# Altium schematic sheet 05_MPU6500.SchDoc
size A4; CheckedBy: <审核日期>; Author: llm; CompanyName: 孔乙己图书店; DocumentNumber: 5; SheetNumber: 5; SheetTotal: 6; PageSetup: Record=PageOptions|CenterHorizontal=True|CenterVertical=True|PrintScale=1.00|XCorrection=1.00|YCorrection=1.00|PrintKind=0|BorderSize=5000000|LeftOffset=0|BottomOffset=0|Orientation=2|PaperLength=1000|PaperWidth=1000|Scale=100|PaperSource=7|PrintQuality=600|MediaType=1|DitherType=10|PaperKind=A4|PrintScaleMode=1; DesignDate: <设计日期>; CheckDate: <审核人员>; SheetName: 姿态检测; SheetVersion: Rev.D; SheetDescription: <图纸描述>; productName: Fly-Balance
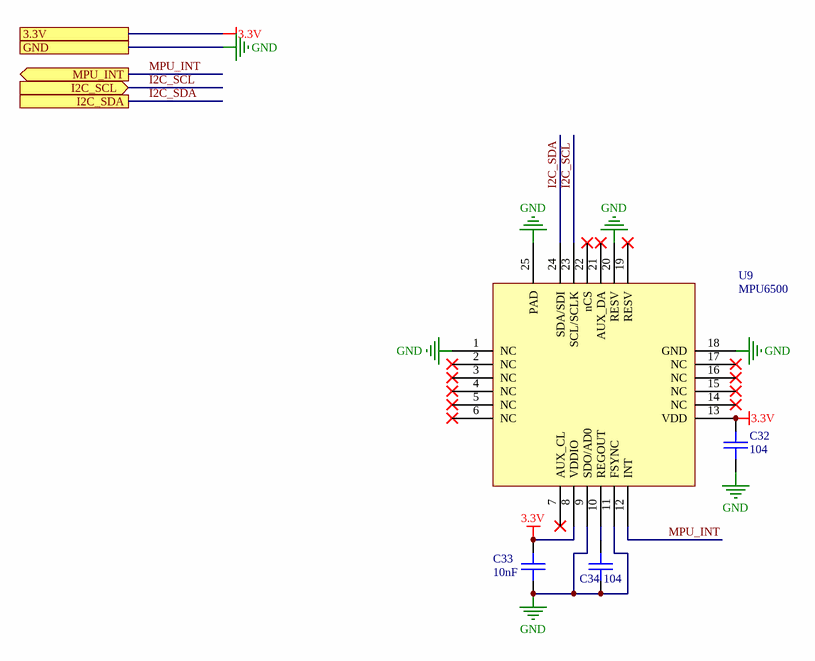
[diagram p0: 05_MPU6500.SchDoc]

## Parts
C32  104  [0402C]
C33  10nF  [0402C]
C34  104  [0402C]
U9  MPU6500  [QFN-24_L3.0-W3.0-P0.40-BL-EP]

## Ports
3.3V, GND, I2C_SCL (in), I2C_SDA, MPU_INT (out)

## Nets
3.3V: C32.1 C33.2 U9.8(VDDIO) U9.13(VDD) ; port 3.3V
GND: C32.2 C33.1 C34.2 U9.1(NC) U9.9(SDO/AD0) U9.11(FSYNC) U9.18(GND) U9.20(RESV) U9.25(PAD) ; port GND
I2C_SCL: U9.23(SCL/SCLK) ; port I2C_SCL
I2C_SDA: U9.24(SDA/SDI) ; port I2C_SDA
MPU_INT: U9.12(INT) ; port MPU_INT
NetC34_1: C34.1 U9.10(REGOUT)

Not connected (* = marked no-connect by the designer): U9 2(NC)* 3(NC)* 4(NC)* 5(NC)* 6(NC)* 7(AUX_CL)* 14(NC)* 15(NC)* 16(NC)* 17(NC)* 19(RESV)* 21(AUX_DA)* 22(nCS)*

## Notes on the sheet
- 1
- #
- 修改日期
- 修改内容
- 2
- 3
- 设计人员
- 审核人员
- 设计日期
- 审核日期
- 产品名称
- 图纸名称
- 产品型号
- 图纸描述
- 图纸版本
- A4

## Library data of the parts
C32-C34 = CAP: 电容
U9 = MPU6500: 三轴加速度计和三轴陀螺仪